# Altium schematic sheet TLV3501.SchDoc
size A4
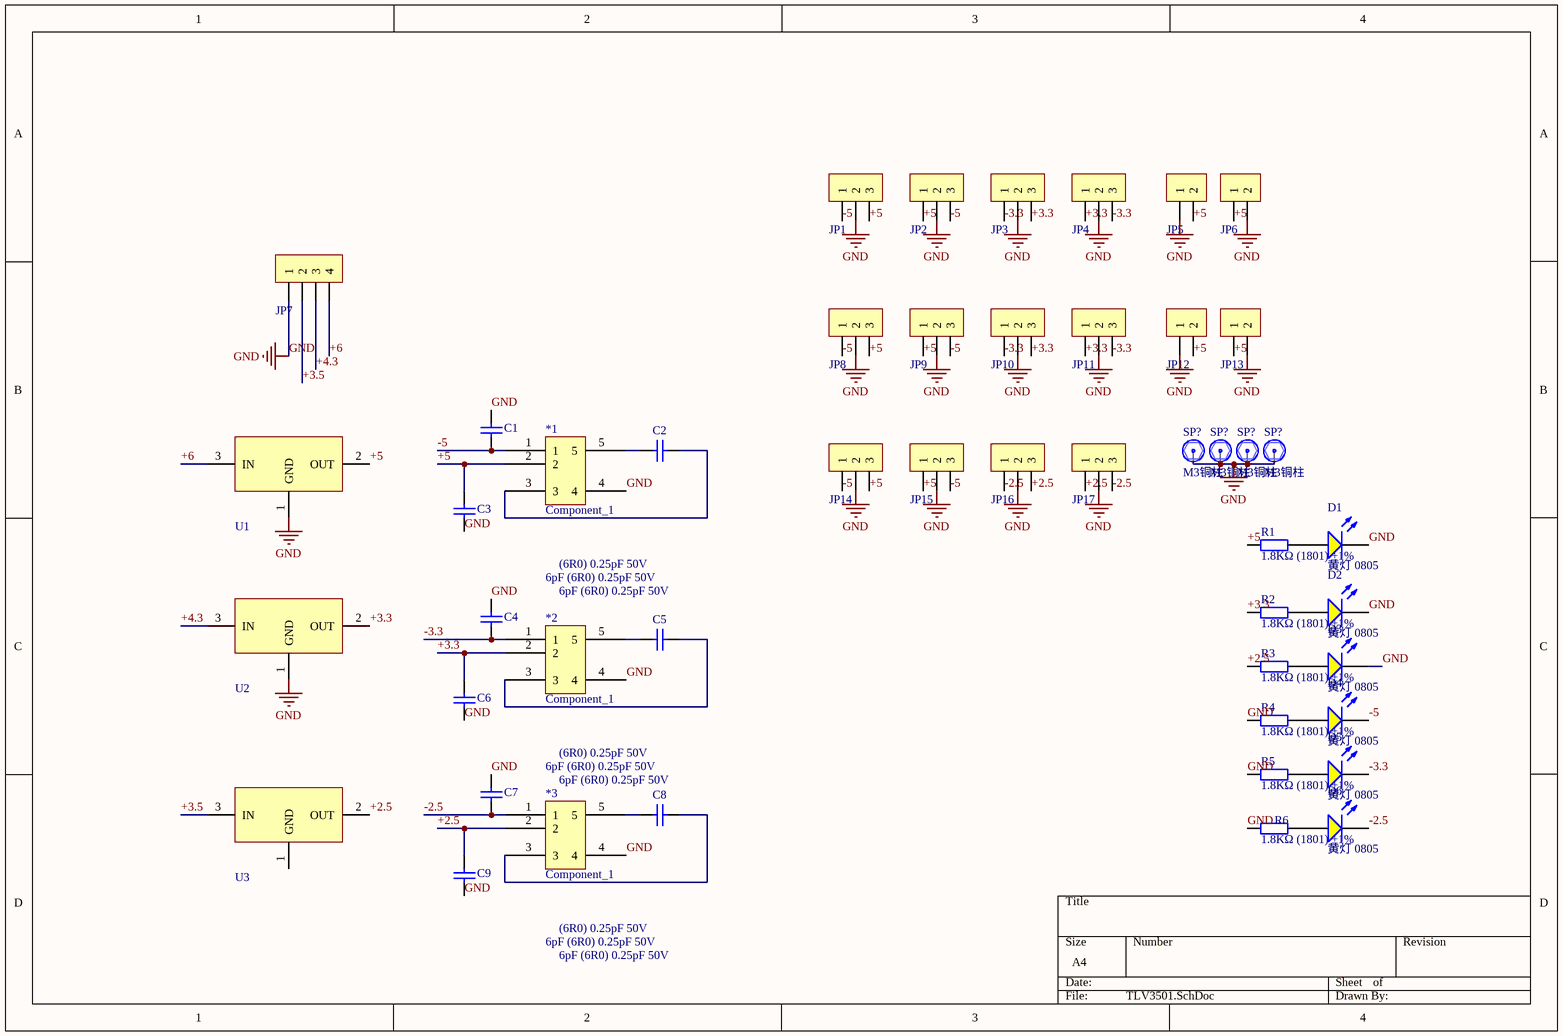
[diagram p0: TLV3501.SchDoc]

## Parts
(Parts that share a designator on the sheet are numbered #1, #2 ... from top to bottom, then left to right.)
*1  Component_1  [SOT23-5N]
*2  Component_1  [SOT23-5N]
*3  Component_1  [SOT23-5N]
C1  6pF (6R0) 0.25pF 50V  [0603_C]
C2  6pF (6R0) 0.25pF 50V  [0603_C]
C3  (6R0) 0.25pF 50V  [0603_C]
C4  6pF (6R0) 0.25pF 50V  [0603_C]
C5  6pF (6R0) 0.25pF 50V  [0603_C]
C6  (6R0) 0.25pF 50V  [0603_C]
C7  6pF (6R0) 0.25pF 50V  [0603_C]
C8  6pF (6R0) 0.25pF 50V  [0603_C]
C9  (6R0) 0.25pF 50V  [0603_C]
D1  黄灯 0805  [0805_LED_S1]
D2  黄灯 0805  [0805_LED_S1]
D3  黄灯 0805  [0805_LED_S1]
D4  黄灯 0805  [0805_LED_S1]
D5  黄灯 0805  [0805_LED_S1]
D6  黄灯 0805  [0805_LED_S1]
JP1  HDR-1X3  [XH2.54-LI-3P]  (value not drawn)
JP2  HDR-1X3  [XH2.54-LI-3P]  (value not drawn)
JP3  HDR-1X3  [XH2.54-LI-3P]  (value not drawn)
JP4  HDR-1X3  [XH2.54-LI-3P]  (value not drawn)
JP5  HDR-1X2  [XH2.54-LI-2P]  (value not drawn)
JP6  HDR-1X2  [XH2.54-LI-2P]  (value not drawn)
JP7  HDR-1X4  [XH2.54-WI-4P]  (value not drawn)
JP8  HDR-1X3  [XH2.54-LI-3P]  (value not drawn)
JP9  HDR-1X3  [XH2.54-LI-3P]  (value not drawn)
JP10  HDR-1X3  [XH2.54-LI-3P]  (value not drawn)
JP11  HDR-1X3  [XH2.54-LI-3P]  (value not drawn)
JP12  HDR-1X2  [XH2.54-LI-2P]  (value not drawn)
JP13  HDR-1X2  [XH2.54-LI-2P]  (value not drawn)
JP14  HDR-1X3  [XH2.54-LI-3P]  (value not drawn)
JP15  HDR-1X3  [XH2.54-LI-3P]  (value not drawn)
JP16  HDR-1X3  [XH2.54-LI-3P]  (value not drawn)
JP17  HDR-1X3  [XH2.54-LI-3P]  (value not drawn)
R1  1.8KΩ (1801) ±1%  [0805_R]
R2  1.8KΩ (1801) ±1%  [0805_R]
R3  1.8KΩ (1801) ±1%  [0805_R]
R4  1.8KΩ (1801) ±1%  [0805_R]
R5  1.8KΩ (1801) ±1%  [0805_R]
R6  1.8KΩ (1801) ±1%  [0805_R]
SP?#1  M3铜柱  [M3x4_L]
SP?#2  M3铜柱  [M3x4_L]
SP?#3  M3铜柱  [M3x4_L]
SP?#4  M3铜柱  [M3x4_L]
U1  LM1117  [1117]  (value not drawn)
U2  LM1117  [1117]  (value not drawn)
U3  LM1117  [1117]  (value not drawn)

## Nets
GND: *1.4 *2.4 *3.4 C1.2 C3.2 C4.2 C6.2 C7.2 C9.2 D1.K D2.K D3.K JP1.2 JP2.2 JP3.2 JP4.2 JP5.1 JP6.2 JP7.1 JP8.2 JP9.2 JP10.2 JP11.2 JP12.1 JP13.2 JP14.2 JP15.2 JP16.2 JP17.2 R4.1 R5.1 R6.1 SP?#1.1 SP?#2.1 SP?#3.1 SP?#4.1 U1.1(GND) U2.1(GND)
+2.5: *3.2 C9.1 JP16.3 JP17.1 R3.1 U3.2(OUT)
+3.3: *2.2 C6.1 JP3.3 JP4.1 JP10.3 JP11.1 R2.1 U2.2(OUT)
+3.5: JP7.2 U3.3(IN)
+4.3: JP7.3 U2.3(IN)
+5: *1.2 C3.1 JP1.3 JP2.1 JP5.2 JP6.1 JP8.3 JP9.1 JP12.2 JP13.1 JP14.3 JP15.1 R1.1 U1.2(OUT)
+6: JP7.4 U1.3(IN)
-2.5: *3.1 C7.1 D6.K JP16.1 JP17.3
-3.3: *2.1 C4.1 D5.K JP3.1 JP4.3 JP10.1 JP11.3
-5: *1.1 C1.1 D4.K JP1.1 JP2.3 JP8.1 JP9.3 JP14.1 JP15.3
Net*1_3: *1.3 C2.2
Net*1_5: *1.5 C2.1
Net*2_3: *2.3 C5.2
Net*2_5: *2.5 C5.1
Net*3_3: *3.3 C8.2
Net*3_5: *3.5 C8.1
NetD1_A: D1.A R1.2
NetD2_A: D2.A R2.2
NetD3_A: D3.A R3.2
NetD4_A: D4.A R4.2
NetD5_A: D5.A R5.2
NetD6_A: D6.A R6.2

Not connected (* = marked no-connect by the designer): U3 1(GND)

## Library data of the parts
C1-C9 = 0603 6pF (6R0) 0.25pF 50V: 贴片电容; ComponentLink1Description: 供应商链接; ComponentLink1URL: http://www.szlcsc.com/product/details_38453.html; Package: 0603; Supplier: LC; SuppliersPartNumber: C37474
D1-D6 = 0805 黄灯: 发光二极管; ComponentLink1Description: 供应商链接; ComponentLink1URL: http://www.szlcsc.com/product/details_2669.html; Package: 0805; Supplier: LC; SuppliersPartNumber: C2296
JP1-JP4 JP8-JP11 JP14-JP17 = Header 3: 3P接插件; BOM名称: 3P接插件
JP5 JP6 JP12 JP13 = Header 2: 2P接插件; BOM名称: 2P接插件
JP7 = Header 4: 4P接插件; BOM名称: 4P接插件
R1-R6 = 0805 1.8KΩ (1801) 1%: 贴片电阻; ComponentLink1Description: 供应商链接; ComponentLink1URL: http://www.szlcsc.com/product/details_18086.html; Package: 0805; Supplier: LC; SuppliersPartNumber: C17398
SP?#1-SP?#4 = 铜柱小焊盘: 铜柱; BOM名称: 铜柱
U1-U3 = LM1117: TI